# Altium project PCB_Project.PrjPcb
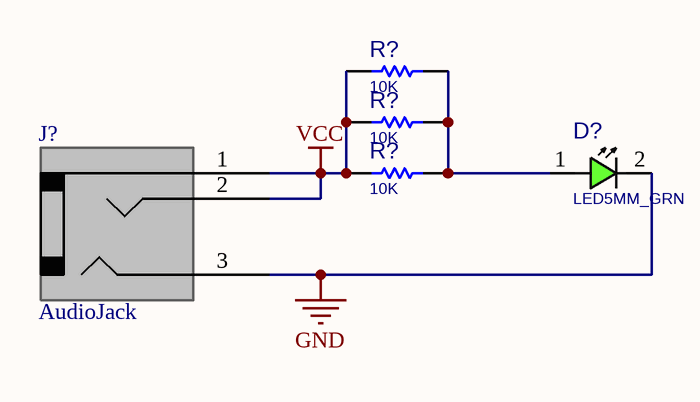
[diagram p0: Sheet1.SchDoc]
1 sheet, 5 parts. Net scope: global (net labels, ports and power ports of the same name join across sheets).
Board file: PCB1.PcbDoc

## Sheet Sheet1.SchDoc
size A4; SheetNumber: 1; SheetTotal: 1

### Parts
(Parts that share a designator on the sheet are numbered #1, #2 ... from top to bottom, then left to right.)
D?  LED5MM_GRN  [LED5MM_GRN]
J?  AudioJack  [JCKAT_STX3000]
R?#1  10K  [R025W_AX04]
R?#2  10K  [R025W_AX04]
R?#3  10K  [R025W_AX04]

### Nets
GND: D?.2(CATHODE) J?.3(RING)
VCC: J?.1(SLEEVE) J?.2(TIP) R?#1.1 R?#2.1 R?#3.1
NetD?_1: D?.1(ANODE) R?#1.2 R?#2.2 R?#3.2

### Library data of the parts
D? = LED_THD_5MM_GRN: LED, THD, 5MM, GREEN; DESC: DESCRIPTION; MANF_P#: MANF_PART#; PARAM2: 2.2V; MANF: MANF; ASSEMBLY: ASSEMBLY; PRICE: PRICE; VALUE: LED5MM_GRN
J? = JACKA3.5THD_STX-3000: Jack, Audio, Stereo, 3.5mm, RA, THD; MANF: Kycon; MANF_P#: STX-3000; PRICE: 1.6$; VALUE: AudioJack
R?#1-R?#3 = RES_THD: RESISTOR, THD; MANF_P#: RK73H1ETTP4701F; MANF: KOA SPEER; PARAM: 0.063W; DESC: DESCRIPTION; DIST#: MOUSER; PARAM2: 1%; ASSEMBLY: ASSEMBLY; PRICE: 100= 0.5$; VALUE: 10K